# Altium schematic sheet DCDC-LMR16030.SchDoc
size A3; Revision: 8
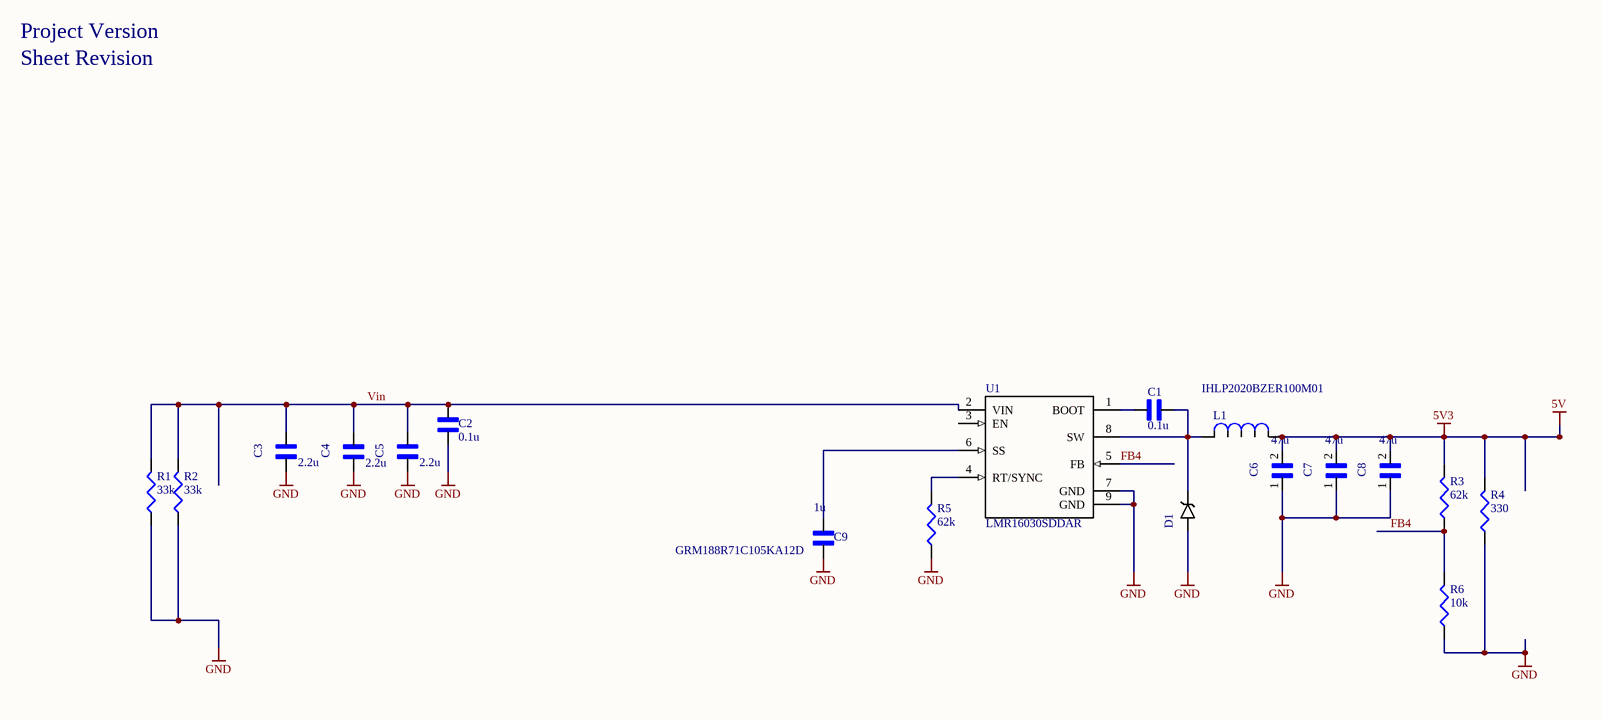
[diagram p0: DCDC-LMR16030.SchDoc]

## Parts
C1  value 0.1u  [CAPC1005X55N]  (hidden comment: GCM155R71H104KE02D)
C2  value 0.1u  [CAPC1005X55N]  (hidden comment: GCM155R71H104KE02D)
C3  value 2.2u  [*CAP3216X125N]  (hidden comment: GRM31CR71H225KA88L)
C4  value 2.2u  [*CAP3216X125N]  (hidden comment: GRM31CR71H225KA88L)
C5  value 2.2u  [*CAP3216X125N]  (hidden comment: GRM31CR71H225KA88L)
C6  value 47u  [*CAPC3216X125N]  (hidden comment: GRM31CR61A476KE15L)
C7  value 47u  [*CAPC3216X125N]  (hidden comment: GRM31CR61A476KE15L)
C8  value 47u  [*CAPC3216X125N]  (hidden comment: GRM31CR61A476KE15L)
C9  GRM188R71C105KA12D  value 1u  [CAPC1608X90N]
D1  SK56  [*SMB_P6SMB62AT3G(Primary)]  (value not drawn)
L1  IHLP2020BZER100M01  [IHLP]
R1  value 33k  [J1-0603]  (hidden comment: RC0603FR-0733KL)
R2  value 33k  [J1-0603]  (hidden comment: RC0603FR-0733KL)
R3  value 62k  [RESC1005X40N]  (hidden comment: RC0402FR-0762KL)
R4  value 330  [J1-0603]  (hidden comment: RC0603FR-07330RL)
R5  value 62k  [RESC1005X40N]  (hidden comment: RC0402FR-0762KL)
R6  value 10k  [RESC1005X40N]  (hidden comment: RC0402FR-0710KL)
U1  LMR16030SDDAR  [*SOIC127P600X170-9N - duplicate]

## Nets
5V: C6.2 C7.2 C8.2 L1.1 R3.2 R4.2  [also labelled 5V3]
GND: C2.2 C3.2 C4.2 C5.2 C6.1 C7.1 C8.1 C9.1 D1.A R1.1 R2.1 R4.1 R5.1 R6.1 U1.7(GND) U1.9(GND)
FB4: R3.1 R6.2 U1.5(FB)
Vin: C2.1 C3.1 C4.1 C5.1 R1.2 R2.2 U1.2(VIN)
NetC1_1: C1.1 D1.C L1.2 U1.8(SW)
NetC1_2: C1.2 U1.1(BOOT)
NetC9_2: C9.2 U1.6(SS)
NetR5_2: R5.2 U1.4(RT/SYNC)

Not connected (* = marked no-connect by the designer): U1 3(EN)

## Notes on the sheet
- Project Version
- Sheet Revision

## Library data of the parts
C1 C2 = GCM155R71H104KE02D: GCM155R71H104KE02D, Чип 0402 X7R 0.1uF +10% 50V,Конденсатор; MF: Murata; Type: SMD; SnapEDA_Link: https://www.snapeda.com/parts/GCM155R71H104KE02D/Murata%20Electronics%20North%20America/view-part/597463/?ref=snap; Package: 0402; MP: GCM155R71H104KE02D; ChipDip_Link: https://www.chipdip.ru/product/gcm155r71h104ke02d-murata
C3-C5 = GRM31CR71H225KA88L: 1206 2.2 uF 50 V В±10% Tolerance X7R SMT Multilayer Ceramic Capacitor; MF: Murata Electronics; Type: SMD; Package: 1206 Murata; SnapEDA_Link: https://www.snapeda.com/parts/GRM31CR71H225KA88L/Murata%20Electronics%20North%20America/view-part/?ref=snap; MP: GRM31CR71H225KA88L
C6-C8 = GRM31CR61A476KE15L: Multilayer Ceramic Capacitor, GRM Series, 47 - F, - 10%, X5R, 10 V, 1206 [3216 Metric]; MF: Murata Electronics; Type: SMD; Package: 1206 Murata Electronics; MP: GRM31CR61A476KE15L; SnapEDA_Link: https://www.snapeda.com/parts/GRM31CR61A476KE15L/Murata%20Electronics%20North%20America/view-part/?ref=snap
C9 = GRM188R71C105KA12D: SMD Capacitor X7R(EIA) with Capacitance: 1.0uF Tol. 10%. Rated Voltage: 16Vdc; MF: Murata Electronics; Pacage Metric: 1608; MP: GRM188R71C105KA12D; SnapEDA_Link: https://www.snapeda.com/parts/GRM188R71C105KA12D/Murata%20Electronics%20North%20America/view-part/228340/?ref=snap; Package: 0603; ChipDip_Link: https://www.chipdip.ru/product/grm188r71c105ka12d; HelpURL: https://static.chipdip.ru/lib/428/DOC005428493.pdf; Type: SMD
D1 = SK56: Диод Шоттки 5А 60В [SMB / DO-214AA]; MP: SK56B; MF: Littelfuse Inc.; Type: SMD; Package: DO-214 Littelfuse; SnapEDA_Link: https://www.snapeda.com/parts/P6SMB62AT3G/Littelfuse%20Inc./view-part/?ref=snap; Value: *; ChipDip_Link: https://www.chipdip.ru/product/sk56
L1 = IHLP2020BZER100M01: 10ÂµH Shielded Molded Inductor 2.3A 199mOhm Max Nonstandard; MF: Vishay Dale; Type: SMD; SnapEDA_Link: https://www.snapeda.com/parts/IHLP2020BZER100M01/Vishay%20Dale/view-part/44808/?ref=snap; MP: IHLP2020BZER100M01; Value: *; Package: Nonstandard Vishay; HelpURL: http://www.vishay.com/docs/34253/ihlp-2020bz-01.pdf; ChipDip_Link: https://www.chipdip.ru/product/ihlp2020bzer100m11-inductor-ihlp-smd-2020-10
R1 R2 = RC0603FR-0733KL: 33 kOhms ±1% 0.1W, 1/10W Chip Resistor 0603 (1608 Metric) Moisture Resistant Thick Film; Pacage Metric: 1608; MF: Yageo or NXP; ChipDip_Link: https://www.chipdip.ru/product0/8001788943?from=suggest_product; HelpURL: https://www.yageo.com/upload/media/product/productsearch/datasheet/rchip/PYu-RC_Group_51_RoHS_L_10.pdf; Package: R0603; Type: SMD; MP: RC0603FR-0733KL
R3 R5 = RC0402FR-0762KL: 0.062Вт 0402 62 кОм, 1%, Чип резистор (SMD); Pacage Metric: 1005; MF: Yageo or NXP; ChipDip_Link: https://www.chipdip.ru/product0/9000189640; HelpURL: https://www.chipdip.ru/product0/9000189640; Package: RC0402; Type: SMD; MP: RC0402FR-0762KL; SnapEDA_Link: https://www.snapeda.com/parts/CRGCQ0402F10K/TE%20Connectivity/view-part/3186991/?ref=search&t=0402%2010k
R4 = RC0603FR-07330RL: 330 Ohms ±1% 0.1W, 1/10W Chip Resistor 0603 (1608 Metric) Thick Film; Pacage Metric: 1608; MF: Yageo or NXP; ChipDip_Link: https://www.chipdip.ru/product0/9000079628; HelpURL: https://www.yageo.com/upload/media/product/productsearch/datasheet/rchip/PYu-RC_Group_51_RoHS_L_10.pdf; Package: R0603; Type: SMD; MP: RC0603FR-07330RL; SnapEDA_Link: https://www.snapeda.com/parts/RC0603FR-07330RL/Yageo/view-part/?ref=search&t=RC0603FR-07330RL
R6 = RC0402FR-0710KL: 0.062Вт 0402 10 кОм, 1%, Чип резистор (SMD); Pacage Metric: 1005; MF: Yageo or NXP; ChipDip_Link: https://www.chipdip.ru/product0/9000189640; HelpURL: https://www.chipdip.ru/product0/9000189640; Package: RC0402; Type: SMD; MP: RC0402FR-0710KL; SnapEDA_Link: https://www.snapeda.com/parts/CRGCQ0402F10K/TE%20Connectivity/view-part/3186991/?ref=search&t=0402%2010k
U1 = LMR16030SDDAR: LMR16030SDDAR, Conv DC-DC 4.3V to 60V Step Down Single-Out 1V to 50V 3A Automotive 8-Pin HSOP EP T/R; MF: Texas Instruments; SnapEDA_Link: https://www.snapeda.com/parts/TPS54560DDA/Texas%20Instruments/view-part/?ref=snap; MP: LMR16030SDDAR; Package: PowerSOIC-8 Texas Instruments; Value: *; Type: SMD; ChipDip_Link: https://www.chipdip.ru/product1/8003448566; HelpURL: https://www.ti.com/lit/ds/symlink/lmr16030.pdf